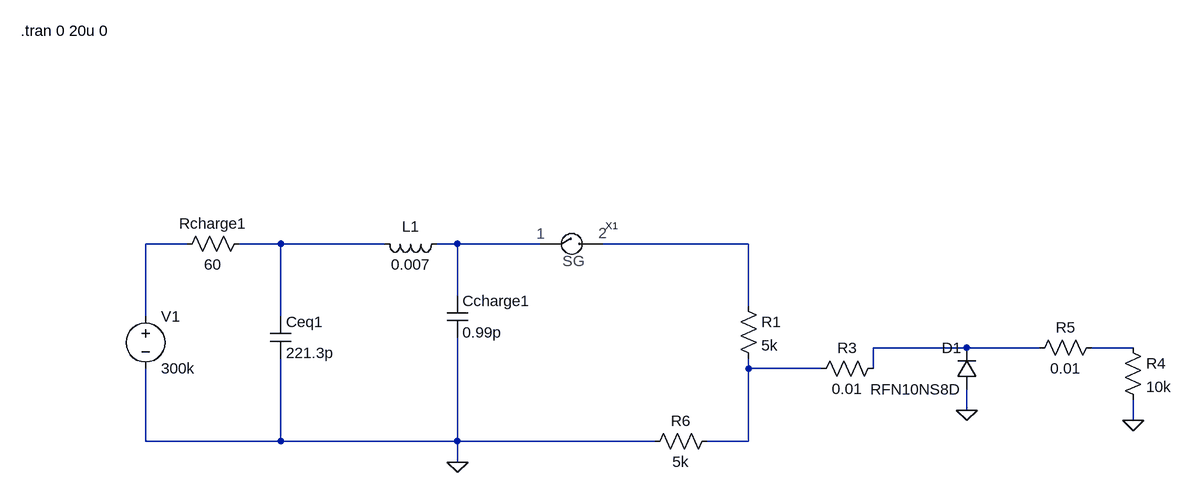
[diagram p0: schematic sg_model_marx_surgesuppressor.asc]
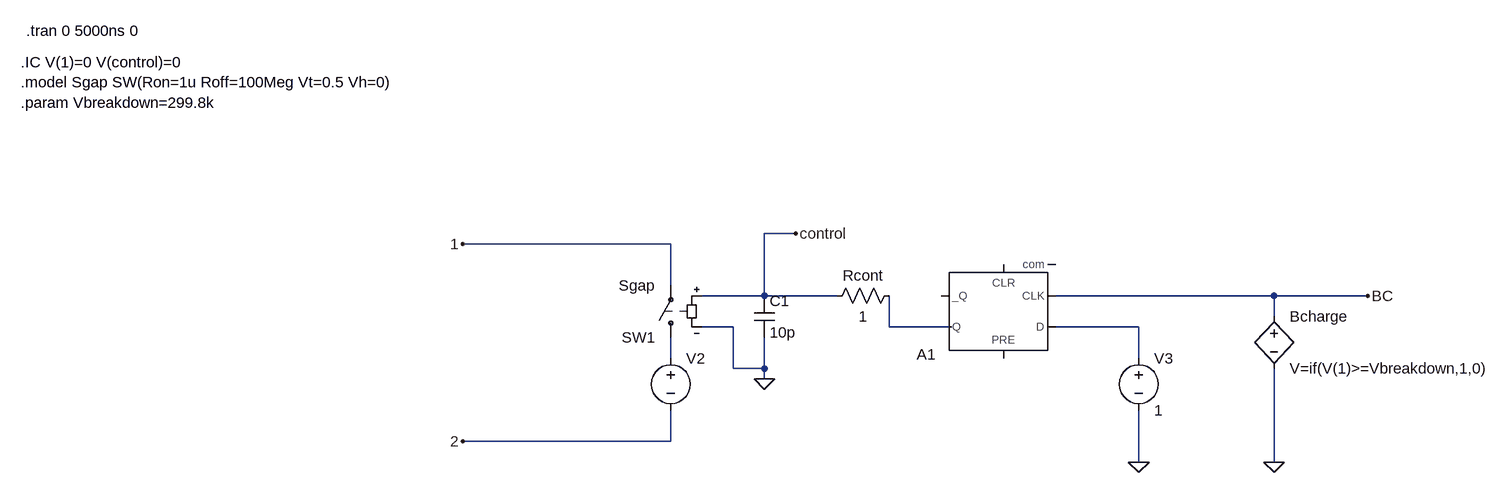
[diagram p1: sub-circuit sg_model.asc]
sg_model_marx_surgesuppressor.asc, the LTspice schematic file:
Version 4
SHEET 1 1316 708
WIRE -208 352 -272 352
WIRE -64 352 -128 352
WIRE 96 352 -64 352
WIRE 208 352 176 352
WIRE 336 352 208 352
WIRE 656 352 432 352
WIRE 208 432 208 352
WIRE 656 448 656 352
WIRE -272 464 -272 352
WIRE -64 464 -64 352
WIRE 992 512 848 512
WIRE 1104 512 992 512
WIRE 1248 512 1184 512
WIRE 656 544 656 528
WIRE 768 544 656 544
WIRE 848 544 848 512
WIRE 992 608 992 576
WIRE 1248 624 1248 592
WIRE -272 656 -272 544
WIRE -64 656 -64 528
WIRE -64 656 -272 656
WIRE 208 656 208 496
WIRE 208 656 -64 656
WIRE 512 656 208 656
WIRE 656 656 656 544
WIRE 656 656 592 656
WIRE 208 688 208 656
FLAG 208 688 0
FLAG 992 608 0
FLAG 1248 624 0
SYMBOL voltage -272 448 R0
WINDOW 123 0 0 Left 0
WINDOW 39 0 0 Left 0
SYMATTR InstName V1
SYMATTR Value 300k
SYMBOL cap 192 432 R0
SYMATTR InstName Ccharge1
SYMATTR Value 0.99p
SYMBOL ind 192 336 R90
WINDOW 0 5 56 VBottom 2
WINDOW 3 32 56 VTop 2
SYMATTR InstName L1
SYMATTR Value 0.007
SYMBOL res 640 432 R0
SYMATTR InstName R1
SYMATTR Value 5k
SYMBOL sg_model 384 352 R0
SYMATTR InstName X1
SYMBOL cap -80 464 R0
SYMATTR InstName Ceq1
SYMATTR Value 221.3p
SYMBOL res -112 336 R90
WINDOW 0 0 56 VBottom 2
WINDOW 3 32 56 VTop 2
SYMATTR InstName Rcharge1
SYMATTR Value 60
SYMBOL diode 1008 576 R180
WINDOW 0 24 64 Left 2
WINDOW 3 24 0 Left 2
SYMATTR InstName D1
SYMATTR Value RFN10NS8D
SYMATTR Description Schottky diode
SYMATTR Type schottky
SYMBOL res 864 528 R90
WINDOW 0 0 56 VBottom 2
WINDOW 3 32 56 VTop 2
SYMATTR InstName R3
SYMATTR Value 0.01
SYMBOL res 1232 496 R0
SYMATTR InstName R4
SYMATTR Value 10k
SYMBOL res 1200 496 R90
WINDOW 0 0 56 VBottom 2
WINDOW 3 32 56 VTop 2
SYMATTR InstName R5
SYMATTR Value 0.01
SYMBOL res 608 640 R90
WINDOW 0 0 56 VBottom 2
WINDOW 3 32 56 VTop 2
SYMATTR InstName R6
SYMATTR Value 5k
TEXT -464 24 Left 2 !.tran 0 20u 0

sg_model.asc, the sub-circuit schematic file:
Version 4
SHEET 1 1600 680
WIRE 464 64 416 64
WIRE 272 80 -48 80
WIRE 272 144 272 80
WIRE 416 160 416 64
WIRE 416 160 320 160
WIRE 528 160 416 160
WIRE 1200 160 864 160
WIRE 1344 160 1200 160
WIRE 1200 192 1200 160
WIRE 368 208 320 208
WIRE 608 208 608 160
WIRE 704 208 608 208
WIRE 992 208 864 208
WIRE 272 256 272 224
WIRE 992 256 992 208
WIRE 368 272 368 208
WIRE 416 272 416 224
WIRE 416 272 368 272
WIRE 416 288 416 272
WIRE 272 384 272 336
WIRE 272 384 -48 384
WIRE 992 416 992 336
WIRE 1200 416 1200 272
FLAG 416 288 0
FLAG 992 416 0
FLAG 1200 416 0
FLAG 464 64 control
FLAG 1344 160 BC
FLAG -48 80 1
FLAG -48 384 2
SYMBOL voltage 992 240 R0
WINDOW 123 0 0 Left 0
WINDOW 39 0 0 Left 0
SYMATTR InstName V3
SYMATTR Value 1
SYMBOL voltage 272 240 R0
WINDOW 123 0 0 Left 0
WINDOW 39 24 44 Left 2
SYMATTR InstName V2
SYMATTR Value ""
SYMBOL res 624 144 R90
WINDOW 0 0 56 VBottom 2
WINDOW 3 32 56 VTop 2
SYMATTR InstName Rcont
SYMATTR Value 1
SYMBOL cap 400 160 R0
SYMATTR InstName C1
SYMATTR Value 10p
SYMBOL bv 1200 176 R0
SYMATTR InstName Bcharge
SYMATTR Value V=if(V(1)>=Vbreakdown,1,0)
SYMBOL Digital\\dflop 784 256 R180
SYMATTR InstName A1
SYMBOL sw 272 240 R180
SYMATTR InstName SW1
SYMATTR Value Sgap
TEXT -728 -200 Left 2 !.IC V(1)=0 V(control)=0\n.model Sgap SW(Ron=1u Roff=100Meg Vt=0.5 Vh=0)\n.param Vbreakdown=299.8k
TEXT -720 -248 Left 2 !.tran 0 5000ns 0

The netlist it stands for:
* sg_model_marx_surgesuppressor.asc
V1 N001 0 300k
Ccharge1 N003 0 0.99p
L1 N003 N002 0.007
R1 N004 N007 5k
XX1 N003 N004 sg_model
Ceq1 N002 0 221.3p
Rcharge1 N002 N001 60
D1 0 N005 RFN10NS8D
R3 N005 N007 0.01
R4 N006 0 10k
R5 N006 N005 0.01
R6 N007 0 5k

* block symbol definitions
.subckt sg_model 1 2
V3 N002 0 1
V2 N003 2
Rcont N001 control 1
C1 control 0 10p
Bcharge BC 0 V=if(V(1)>=Vbreakdown,1,0)
A1 N002 0 BC 0 0 0 N001 0 DFLOP
SW1 N003 1 control 0 Sgap
.IC V(1)=0 V(control)=0
.model Sgap SW(Ron=1u Roff=100Meg Vt=0.5 Vh=0)
.param Vbreakdown=299.8k
.tran 0 5000ns 0
.ends sg_model

.model D D
.lib standard.dio
.tran 0 20u 0
.backanno
.end